# EAGLE design 6_Channel_Pulse_Generator (EAGLE 8.0.0)
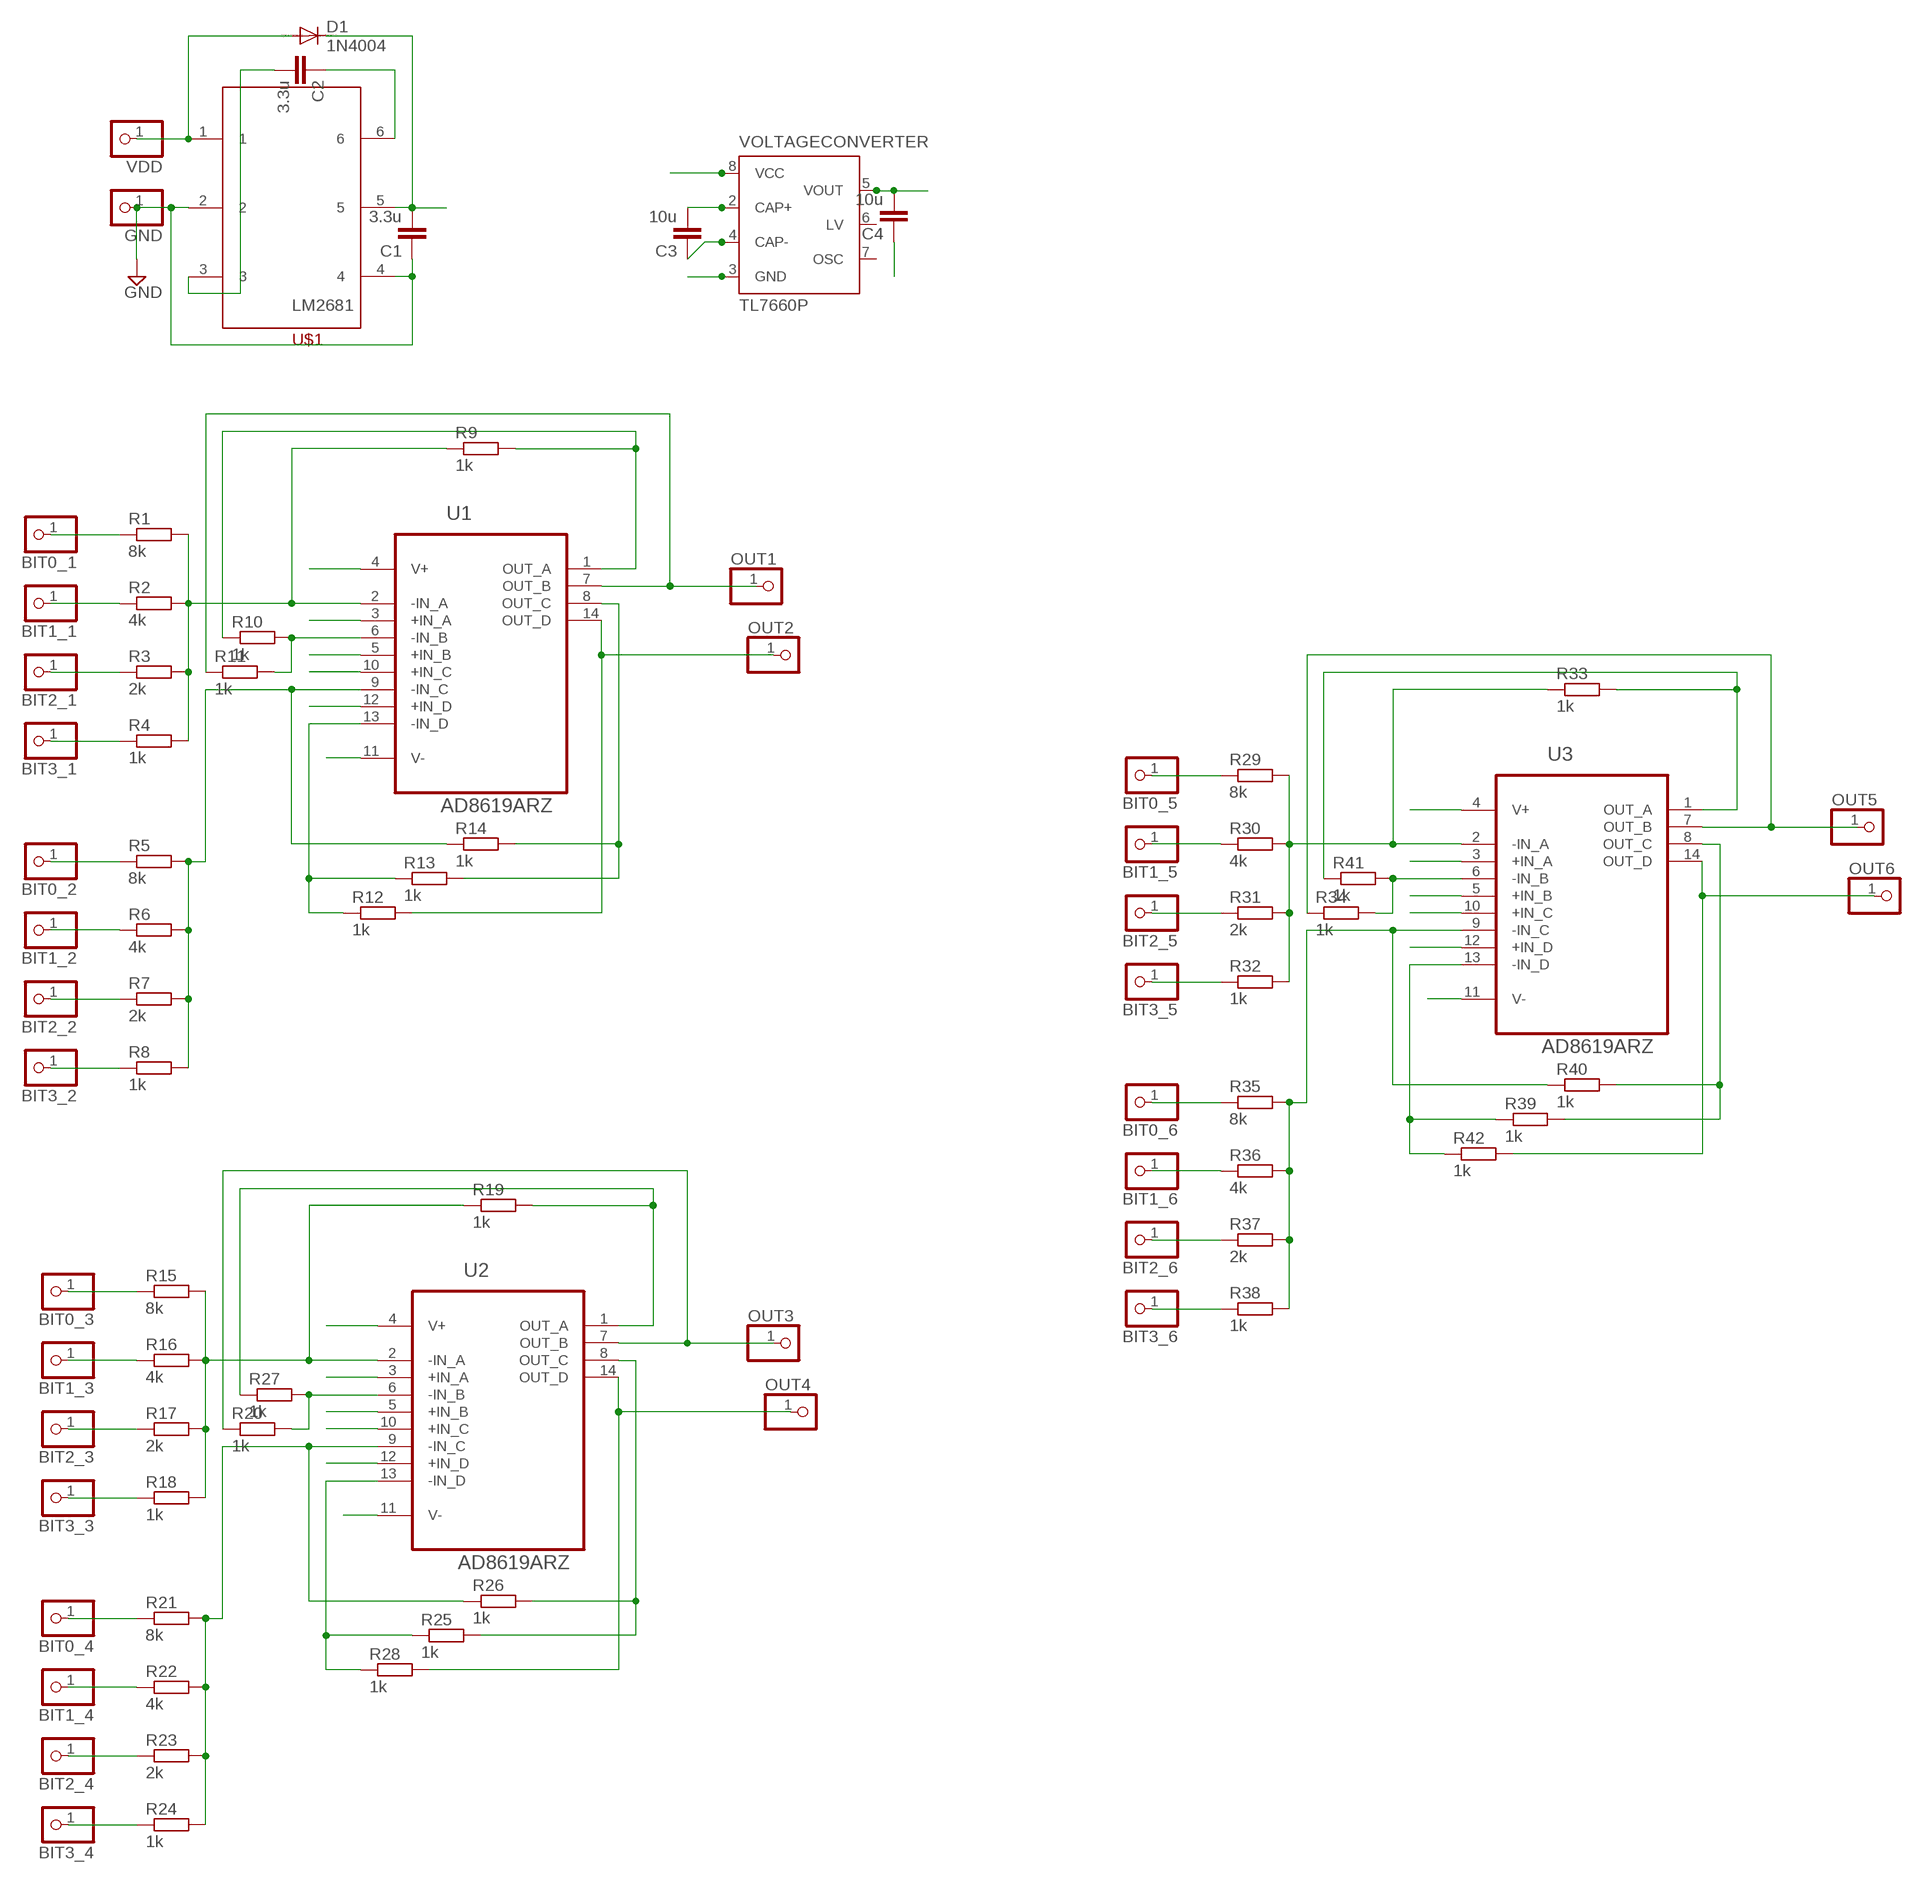
[diagram p0: schematic, sheet 1]

## Parts
BIT0_1  PINHD-1X1  [1X01]
BIT0_2  PINHD-1X1  [1X01]
BIT0_3  PINHD-1X1  [1X01]
BIT0_4  PINHD-1X1  [1X01]
BIT0_5  PINHD-1X1  [1X01]
BIT0_6  PINHD-1X1  [1X01]
BIT1_1  PINHD-1X1  [1X01]
BIT1_2  PINHD-1X1  [1X01]
BIT1_3  PINHD-1X1  [1X01]
BIT1_4  PINHD-1X1  [1X01]
BIT1_5  PINHD-1X1  [1X01]
BIT1_6  PINHD-1X1  [1X01]
BIT2_1  PINHD-1X1  [1X01]
BIT2_2  PINHD-1X1  [1X01]
BIT2_3  PINHD-1X1  [1X01]
BIT2_4  PINHD-1X1  [1X01]
BIT2_5  PINHD-1X1  [1X01]
BIT2_6  PINHD-1X1  [1X01]
BIT3_1  PINHD-1X1  [1X01]
BIT3_2  PINHD-1X1  [1X01]
BIT3_3  PINHD-1X1  [1X01]
BIT3_4  PINHD-1X1  [1X01]
BIT3_5  PINHD-1X1  [1X01]
BIT3_6  PINHD-1X1  [1X01]
C1  3.3u  C-EUC1206  [C1206]
C2  3.3u  C-EUC1206  [C1206]
C3  10u  C-EUC1206  [C1206]
C4  10u  C-EUC1206  [C1206]
D1  1N4004  [DO41-10]
GND  PINHD-1X1  [1X01]
OUT1  PINHD-1X1  [1X01]
OUT2  PINHD-1X1  [1X01]
OUT3  PINHD-1X1  [1X01]
OUT4  PINHD-1X1  [1X01]
OUT5  PINHD-1X1  [1X01]
OUT6  PINHD-1X1  [1X01]
R1  8k  R-EU_M1206  [M1206]
R2  4k  R-EU_M1206  [M1206]
R3  2k  R-EU_M1206  [M1206]
R4  1k  R-EU_M1206  [M1206]
R5  8k  R-EU_M1206  [M1206]
R6  4k  R-EU_M1206  [M1206]
R7  2k  R-EU_M1206  [M1206]
R8  1k  R-EU_M1206  [M1206]
R9  1k  R-EU_M1206  [M1206]
R10  1k  R-EU_M1206  [M1206]
R11  1k  R-EU_M1206  [M1206]
R12  1k  R-EU_M1206  [M1206]
R13  1k  R-EU_M1206  [M1206]
R14  1k  R-EU_M1206  [M1206]
R15  8k  R-EU_M1206  [M1206]
R16  4k  R-EU_M1206  [M1206]
R17  2k  R-EU_M1206  [M1206]
R18  1k  R-EU_M1206  [M1206]
R19  1k  R-EU_M1206  [M1206]
R20  1k  R-EU_M1206  [M1206]
R21  8k  R-EU_M1206  [M1206]
R22  4k  R-EU_M1206  [M1206]
R23  2k  R-EU_M1206  [M1206]
R24  1k  R-EU_M1206  [M1206]
R25  1k  R-EU_M1206  [M1206]
R26  1k  R-EU_M1206  [M1206]
R27  1k  R-EU_M1206  [M1206]
R28  1k  R-EU_M1206  [M1206]
R29  8k  R-EU_M1206  [M1206]
R30  4k  R-EU_M1206  [M1206]
R31  2k  R-EU_M1206  [M1206]
R32  1k  R-EU_M1206  [M1206]
R33  1k  R-EU_M1206  [M1206]
R34  1k  R-EU_M1206  [M1206]
R35  8k  R-EU_M1206  [M1206]
R36  4k  R-EU_M1206  [M1206]
R37  2k  R-EU_M1206  [M1206]
R38  1k  R-EU_M1206  [M1206]
R39  1k  R-EU_M1206  [M1206]
R40  1k  R-EU_M1206  [M1206]
R41  1k  R-EU_M1206  [M1206]
R42  1k  R-EU_M1206  [M1206]
U1  AD8619ARZ  [SOIC127P600X175-14N]
U2  AD8619ARZ  [SOIC127P600X175-14N]
U3  AD8619ARZ  [SOIC127P600X175-14N]
U$1  LM2681  [LM2681]
VDD  PINHD-1X1  [1X01]
VOLTAGECONVERTER  TL7660P  [DIL08]

## Nets
GND: C1.1 C4.1 GND.1 U1.3(+IN_A) U1.5(+IN_B) U1.10(+IN_C) U1.12(+IN_D) U2.3(+IN_A) U2.5(+IN_B) U2.10(+IN_C) U2.12(+IN_D) U3.3(+IN_A) U3.5(+IN_B) U3.10(+IN_C) U3.12(+IN_D) U$1.2 U$1.4 VOLTAGECONVERTER.3(GND)
N$1: BIT0_1.1 R1.1
N$2: C2.2 U$1.3
N$3: C3.2 VOLTAGECONVERTER.2(CAP+)
N$4: C3.1 VOLTAGECONVERTER.4(CAP-)
N$5: BIT1_1.1 R2.1
N$6: BIT2_1.1 R3.1
N$7: BIT3_1.1 R4.1
N$8: BIT0_2.1 R5.1
N$9: BIT2_2.1 R7.1
N$10: BIT3_2.1 R8.1
N$11: BIT1_2.1 R6.1
N$12: R1.2 R2.2 R3.2 R4.2 R9.1 U1.2(-IN_A)
N$13: R5.2 R6.2 R7.2 R8.2 R14.1 U1.9(-IN_C)
N$14: R13.2 R14.2 U1.8(OUT_C)
N$15: OUT2.1 R12.2 U1.14(OUT_D)
N$16: R12.1 R13.1 U1.13(-IN_D)
N$17: R9.2 R10.1 U1.1(OUT_A)
N$18: OUT1.1 R11.1 U1.7(OUT_B)
N$19: R10.2 R11.2 U1.6(-IN_B)
N$20: C2.1 U$1.6
N$21: BIT0_3.1 R15.1
N$22: BIT2_3.1 R17.1
N$23: BIT3_3.1 R18.1
N$24: BIT1_3.1 R16.1
N$25: BIT0_4.1 R21.1
N$26: BIT2_4.1 R23.1
N$27: BIT3_4.1 R24.1
N$28: BIT1_4.1 R22.1
N$29: R15.2 R16.2 R17.2 R18.2 R19.1 U2.2(-IN_A)
N$30: R19.2 R27.1 U2.1(OUT_A)
N$31: OUT3.1 R20.1 U2.7(OUT_B)
N$32: R20.2 R27.2 U2.6(-IN_B)
N$33: R21.2 R22.2 R23.2 R24.2 R26.1 U2.9(-IN_C)
N$34: R25.2 R26.2 U2.8(OUT_C)
N$35: R25.1 R28.1 U2.13(-IN_D)
N$36: OUT4.1 R28.2 U2.14(OUT_D)
N$37: BIT0_5.1 R29.1
N$38: BIT2_5.1 R31.1
N$39: BIT3_5.1 R32.1
N$40: BIT1_5.1 R30.1
N$41: BIT0_6.1 R35.1
N$42: BIT2_6.1 R37.1
N$43: BIT3_6.1 R38.1
N$44: BIT1_6.1 R36.1
N$45: R29.2 R30.2 R31.2 R32.2 R33.1 U3.2(-IN_A)
N$46: R33.2 R41.1 U3.1(OUT_A)
N$47: OUT5.1 R34.1 U3.7(OUT_B)
N$48: R34.2 R41.2 U3.6(-IN_B)
N$49: R35.2 R36.2 R37.2 R38.2 R40.1 U3.9(-IN_C)
N$50: R39.2 R40.2 U3.8(OUT_C)
N$51: R39.1 R42.1 U3.13(-IN_D)
N$52: OUT6.1 R42.2 U3.14(OUT_D)
VDD: C1.2 D1.C U1.4(V+) U2.4(V+) U3.4(V+) U$1.5 VOLTAGECONVERTER.8(VCC)
VDD-: C4.2 U1.11(V-) U2.11(V-) U3.11(V-) VOLTAGECONVERTER.5(VOUT)
VDD_3.3: D1.A U$1.1 VDD.1
Unconnected: VOLTAGECONVERTER.6(LV) VOLTAGECONVERTER.7(OSC)

## Library data of the parts
BIT0_1-BIT0_6 BIT1_1-BIT1_6 BIT2_1-BIT2_6 BIT3_1-BIT3_6 GND OUT1-OUT6 VDD = pinhead:PINHD-1X1: PIN HEADER
C1-C4 = rcl:C-EU: CAPACITOR, European symbol
D1 = diode:1N4004: DIODE general purpose rectifier, 1 A
R1-R42 = rcl:R-EU_: RESISTOR, European symbol
U1-U3 = AD8619ARZ:AD8619ARZ: Operational Amplifiers; AVAILABILITY: Good; DESCRIPTION: OP Amp Quad GP R-R I/O ???}2.5V/5V 14-Pin SOIC N Tube; MF: Analog Devices; MP: AD8619ARZ; PACKAGE: SOIC-14 Analog Devices; PRICE: 1.96 USD
U$1 = LM2681:LM2681
VOLTAGECONVERTER = texas:TL7660: CMOS VOLTAGE CONVERTER Source: http://focus.ti.com/lit/ds/scas794/scas794.pdf; MPN: TL7660CP; OC_FARNELL: 1755283; OC_NEWARK: 14M2447

## Board
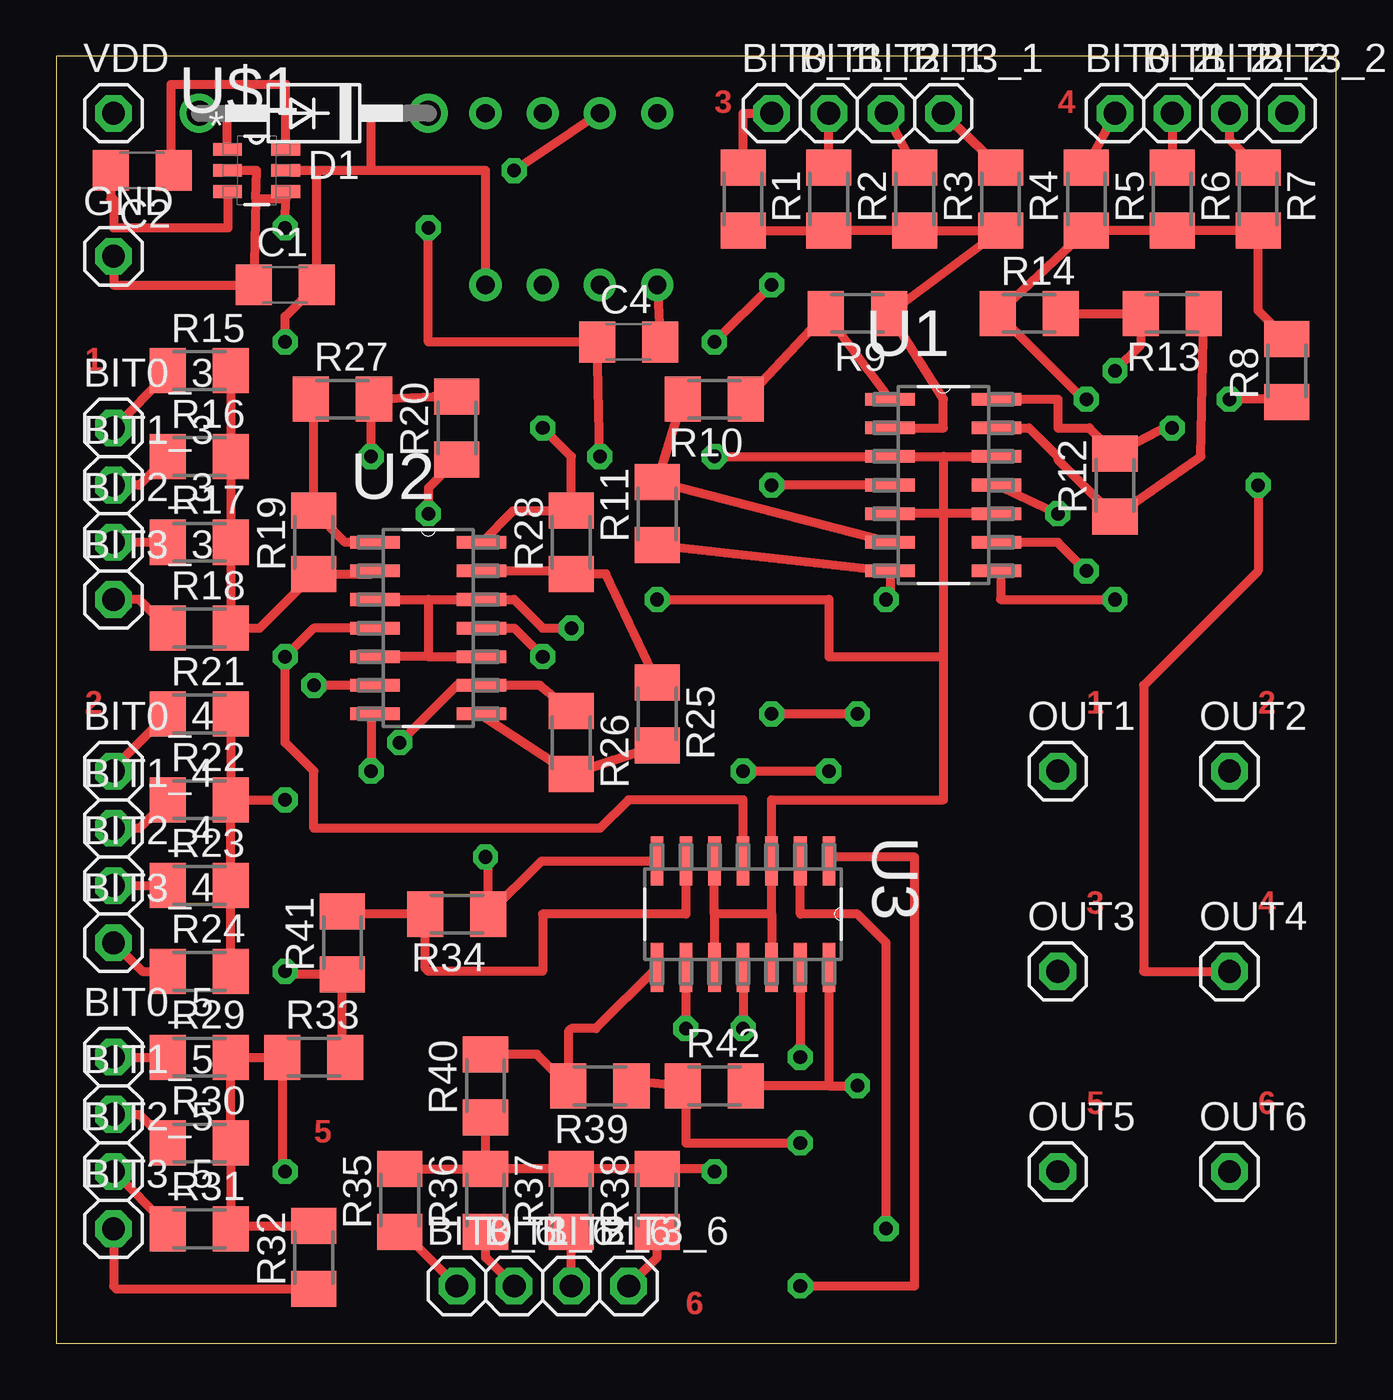
[diagram p1: board, top side]
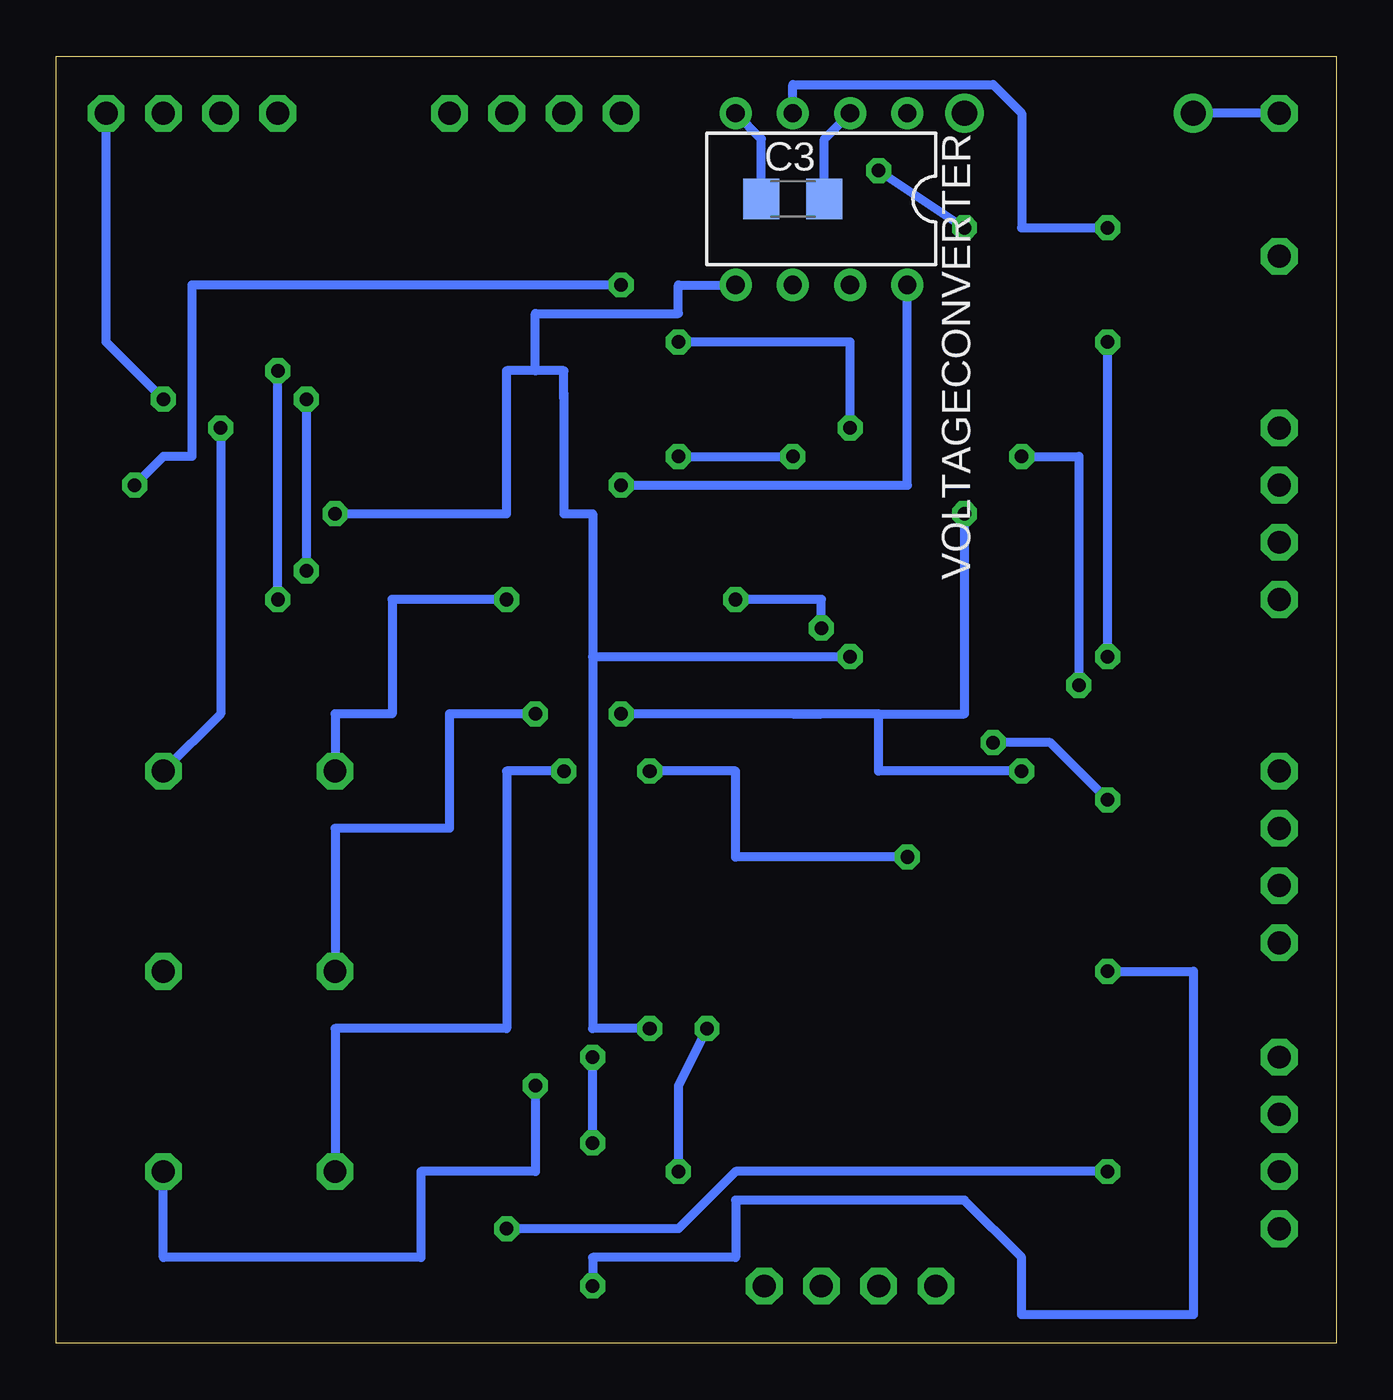
[diagram p2: board, bottom side, seen from below]

Size 56.82 x 57.14 mm. Coordinates in mm from the lower left corner, seen from the top.
Outline: 0,0 56.82,0 56.82,57.14 0,57.14 0,0
Copper layers (1*16): Top 0.035mm / dielectric 1.5mm / Bottom 0.035mm
Design rules "AdvancedCircuitsBarebones": minimum track width 6mil, minimum drill 20mil, track to track 6mil, track to pad 6mil, pad to pad 6mil, via to via 6mil, smd to smd 6mil, copper to edge 10mil, drill to drill 6mil, minimum pad ring 12mil, minimum via ring 10mil, stop-mask expansion 4mil, vias tented up to drill 25mil, thermal gap 10mil

### Footprints (pad centres in the part's own frame; a part is rotated, then mirrored left to right if it is on the bottom)
1X01 = drill 1.016 octagon: 1 0,0
C1206 = smd 1.6 x 1.8: 1 -1.4,0; 2 1.4,0
DO41-10 = drill 1.118: A 5.08,0; C -5.08,0
M1206 = smd 1.6 x 2: 1 -1.4,0; 2 1.4,0
SOIC127P600X175-14N = smd 2.184 x 0.559: 1 -2.362,3.81; 2 -2.362,2.54; 3 -2.362,1.27; 4 -2.362,0; 5 -2.362,-1.27; 6 -2.362,-2.54; 7 -2.362,-3.81; 8 2.362,-3.81; 9 2.362,-2.54; 10 2.362,-1.27; 11 2.362,0; 12 2.362,1.27; 13 2.362,2.54; 14 2.362,3.81
LM2681 = smd 1.27 x 0.559: 1 -1.295,0.94; 2 -1.295,0; 3 -1.295,-0.94; 4 1.295,-0.94; 5 1.295,0; 6 1.295,0.94
DIL08 = drill 0.813 pad 1.27: 1 -3.81,-3.81; 2 -1.27,-3.81; 3 1.27,-3.81; 4 3.81,-3.81; 5 3.81,3.81; 6 1.27,3.81; 7 -1.27,3.81; 8 -3.81,3.81

### Placement (x,y rotation side)
BIT0_1  31.75,54.61 0 top
BIT0_2  46.99,54.61 0 top
BIT0_3  2.54,40.64 0 top
BIT0_4  2.54,25.4 0 top
BIT0_5  2.54,12.7 0 top
BIT0_6  17.78,2.54 0 top
BIT1_1  34.29,54.61 0 top
BIT1_2  49.53,54.61 0 top
BIT1_3  2.54,38.1 0 top
BIT1_4  2.54,22.86 0 top
BIT1_5  2.54,10.16 0 top
BIT1_6  20.32,2.54 0 top
BIT2_1  36.83,54.61 0 top
BIT2_2  52.07,54.61 0 top
BIT2_3  2.54,35.56 0 top
BIT2_4  2.54,20.32 0 top
BIT2_5  2.54,7.62 0 top
BIT2_6  22.86,2.54 0 top
BIT3_1  39.37,54.61 0 top
BIT3_2  54.61,54.61 0 top
BIT3_3  2.54,33.02 0 top
BIT3_4  2.54,17.78 0 top
BIT3_5  2.54,5.08 0 top
BIT3_6  25.4,2.54 0 top
C1  10.16,46.99 0 top
C2  3.81,52.07 180 top
C3  24.13,50.8 0 bottom
C4  25.4,44.45 0 top
D1  11.43,54.61 180 top
GND  2.54,48.26 0 top
OUT1  44.45,25.4 0 top
OUT2  52.07,25.4 0 top
OUT3  44.45,16.51 0 top
OUT4  52.07,16.51 0 top
OUT5  44.45,7.62 0 top
OUT6  52.07,7.62 0 top
R1  30.48,50.8 270 top
R2  34.29,50.8 270 top
R3  38.1,50.8 270 top
R4  41.91,50.8 270 top
R5  45.72,50.8 270 top
R6  49.53,50.8 270 top
R7  53.34,50.8 270 top
R8  54.61,43.18 90 top
R9  35.56,45.72 180 top
R10  29.21,41.91 180 top
R11  26.67,36.83 90 top
R12  46.99,38.1 90 top
R13  49.53,45.72 180 top
R14  43.18,45.72 0 top
R15  6.35,43.18 0 top
R16  6.35,39.37 0 top
R17  6.35,35.56 0 top
R18  6.35,31.75 0 top
R19  11.43,35.56 90 top
R20  17.78,40.64 90 top
R21  6.35,27.94 0 top
R22  6.35,24.13 0 top
R23  6.35,20.32 0 top
R24  6.35,16.51 0 top
R25  26.67,27.94 270 top
R26  22.86,26.67 270 top
R27  12.7,41.91 0 top
R28  22.86,35.56 90 top
R29  6.35,12.7 0 top
R30  6.35,8.89 0 top
R31  6.35,5.08 0 top
R32  11.43,3.81 90 top
R33  11.43,12.7 0 top
R34  17.78,19.05 180 top
R35  15.24,6.35 90 top
R36  19.05,6.35 90 top
R37  22.86,6.35 90 top
R38  26.67,6.35 90 top
R39  24.13,11.43 180 top
R40  19.05,11.43 90 top
R41  12.7,17.78 90 top
R42  29.21,11.43 0 top
U1  39.37,38.1 0 top
U2  16.51,31.75 0 top
U3  30.48,19.05 270 top
U$1  8.89,52.07 0 top
VDD  2.54,54.61 0 top
VOLTAGECONVERTER  22.86,50.8 180 bottom

### Tracks (layer width: path | path; a pad name or v marks a point on that pad's centre or on a via)
GND  (via drill 0.6)
  Top 0.406: GND.1 2.54,46.99 C1.1 8.86,50.8 | v10.16,49.53 U$1.4 10.19,50.8 8.86,50.8 | 8.86,50.8 8.89,52.07 U$1.2 | v16.51,49.53 16.51,44.45 C4.1 v24.13,39.37 | v20.32,52.07 VOLTAGECONVERTER.3 | v29.21,39.37 U1.3 39.37,39.37 | 39.37,39.37 U1.12 | U1.10 39.37,36.83 | 39.37,36.83 U1.5 | 39.37,39.37 39.37,36.83 | U2.3 16.51,33.02 | 16.51,33.02 U2.12 20.32,33.02 21.59,31.75 v22.86,31.75 | 16.51,30.48 U2.5 | 16.51,30.48 U2.10 | 16.51,33.02 16.51,30.48 | 31.75,19.05 U3.3 31.75,24.13 39.37,24.13 39.37,30.48 | 31.75,19.05 U3.12 | 29.21,19.05 U3.10 | 29.21,19.05 U3.5 | 31.75,19.05 29.21,19.05 | v26.67,33.02 34.29,33.02 34.29,30.48 39.37,30.48 | 39.37,36.83 39.37,30.48
  Bottom 0.406: VOLTAGECONVERTER.3 24.13,55.88 15.24,55.88 13.97,54.61 13.97,49.53 v10.16,49.53 | v16.51,49.53 v20.32,52.07 | v29.21,39.37 v24.13,39.37 | v22.86,31.75 22.86,33.02 v26.67,33.02
N$1
  Top 0.406: R1.1 30.48,54.61 BIT0_1.1
N$2
  Top 0.406: C2.2 2.41,50.8 2.54,50.8 2.54,49.53 7.62,49.53 7.62,51.13 U$1.3
N$3
  Bottom 0.406: C3.2 22.73,53.47 VOLTAGECONVERTER.2
N$4
  Bottom 0.406: C3.1 25.53,53.47 VOLTAGECONVERTER.4
N$5
  Top 0.406: R2.1 BIT1_1.1
N$6
  Top 0.406: R3.1 BIT2_1.1
N$7
  Top 0.406: BIT3_1.1 R4.1
N$8
  Top 0.406: BIT0_2.1 R5.1
N$9
  Top 0.406: BIT2_2.1 52.07,53.47 R7.1
N$10  (via drill 0.6)
  Top 0.406: R8.1 54.48,41.91 v52.07,41.91
  Bottom 0.406: v52.07,41.91 54.61,44.45 BIT3_2.1
N$11
  Top 0.406: BIT1_2.1 R6.1
N$12
  Top 0.406: R1.2 R2.2 R3.2 R4.2 R9.1 39.37,41.91 39.37,40.64 U1.2
N$13  (via drill 0.6)
  Top 0.406: R8.2 53.34,45.85 R7.2 R6.2 R5.2 R14.1 45.59,41.91 v45.72,41.91 | v45.72,34.29 44.45,35.56 U1.9
  Bottom 0.406: v45.72,41.91 v45.72,34.29
N$14  (via drill 0.6)
  Top 0.406: R14.2 R13.2 48.13,44.32 v46.99,43.18 | U1.8 41.91,34.11 41.91,33.02 v46.99,33.02
  Bottom 0.406: v46.99,33.02 v46.99,43.18
N$15  (via drill 0.6)
  Top 0.406: v49.53,40.64 49.4,40.77 R12.2 45.85,40.64 44.45,40.64 44.45,41.91 U1.14
  Bottom 0.406: OUT2.1 49.53,27.94 v49.53,40.64
N$16
  Top 0.406: R13.1 50.8,39.37 R12.1 44.45,39.24 44.45,39.37 43.18,40.64 U1.13
N$17
  Top 0.406: R10.1 R9.2 U1.1
N$18  (via drill 0.6)
  Top 0.406: R11.1 U1.7 37.01,33.2 v36.83,33.02
  Bottom 0.406: v36.83,33.02 41.91,33.02 41.91,27.94 44.45,27.94 OUT1.1
N$19
  Top 0.406: R10.2 R11.2 U1.6
N$20
  Top 0.406: U$1.6 10.19,55.88 5.08,55.88 5.08,52.07 C2.1
N$21
  Top 0.406: BIT0_3.1 4.95,43.05 R15.1
N$22
  Top 0.406: R17.1 BIT2_3.1
N$23
  Top 0.406: R18.1 3.68,33.02 BIT3_3.1
N$24
  Top 0.406: R16.1 3.68,38.1 BIT1_3.1
N$25
  Top 0.406: R21.1 2.54,25.53 BIT0_4.1
N$26
  Top 0.406: BIT2_4.1 R23.1
N$27
  Top 0.406: BIT3_4.1 3.81,16.51 R24.1
N$28
  Top 0.406: R22.1 3.68,22.86 BIT1_4.1
N$29
  Top 0.406: R15.2 R16.2 R17.2 R18.2 9.02,31.75 R19.1 14.02,34.16 U2.2
N$30
  Top 0.406: R27.1 11.43,41.78 R19.2 12.83,35.56 U2.1
N$31  (via drill 0.6)
  Top 0.406: R20.1 16.51,37.97 v16.51,36.83 | U2.7 13.97,27.76 v13.97,25.4 | v35.56,27.94 v31.75,27.94
  Bottom 0.406: 24.13,27.94 v31.75,27.94 | 24.13,27.94 22.86,27.94 | v35.56,27.94 39.37,27.94 39.37,22.86 44.45,22.86 OUT3.1 | v16.51,36.83 16.51,27.94 20.32,27.94 | 20.32,27.94 24.13,27.94 | v13.97,25.4 20.32,25.4 20.32,27.94
N$32  (via drill 0.6)
  Top 0.406: R20.2 16.77,42.04 R27.2 13.97,41.78 v13.97,39.37 | U2.6 v11.43,29.21
  Bottom 0.406: v13.97,39.37 11.43,39.37 v11.43,29.21
N$33  (via drill 0.6)
  Top 0.406: R21.2 R22.2 | R22.2 R23.2 R24.2 | R26.1 21.46,29.21 U2.9 17.78,29.21 v15.24,26.67 | R22.2 v10.16,24.13
  Bottom 0.406: v10.16,24.13 12.7,26.67 v15.24,26.67
N$34
  Top 0.406: R25.2 R26.2 19,27.81 U2.8
N$35
  Top 0.406: R25.1 24.39,34.16 R28.1 22.73,34.29 U2.13
N$36  (via drill 0.6)
  Top 0.406: U2.14 20.27,36.96 R28.2 22.86,39.37 v21.59,40.64 | v29.21,44.45 v31.75,46.99 | v53.34,38.1 53.34,34.29 48.26,29.21 48.26,16.51 OUT4.1
  Bottom 0.406: v53.34,38.1 52.07,39.37 50.8,39.37 50.8,46.99 v31.75,46.99 | v21.59,40.64 21.59,44.45 v29.21,44.45
N$37
  Top 0.406: BIT0_5.1 R29.1
N$38
  Top 0.406: BIT2_5.1 4.95,5.21 R31.1
N$39
  Top 0.406: BIT3_5.1 2.54,2.54 2.67,2.41 R32.1
N$40
  Top 0.406: BIT1_5.1 3.68,10.16 R30.1
N$41
  Top 0.406: BIT0_6.1 15.37,4.95 R35.1
N$42
  Top 0.406: BIT2_6.1 R37.1
N$43
  Top 0.406: BIT3_6.1 26.67,3.81 R38.1
N$44
  Top 0.406: BIT1_6.1 19.05,3.81 R36.1
N$45  (via drill 0.6)
  Top 0.406: R32.2 7.88,5.21 R31.2 R30.2 R29.2 R33.1 10.03,7.75 v10.16,7.62 | v36.83,5.08 36.83,17.78 35.56,19.05 33.02,19.05 U3.2
  Bottom 0.406: v10.16,7.62 26.67,7.62 29.21,5.08 v36.83,5.08
N$46  (via drill 0.6)
  Top 0.406: R33.2 12.7,12.83 R41.1 10.29,16.38 v10.16,16.51 | v33.02,2.54 38.1,2.54 38.1,21.59 34.47,21.59 U3.1
  Bottom 0.406: v10.16,16.51 6.35,16.51 6.35,1.27 13.97,1.27 13.97,3.81 16.51,6.35 26.67,6.35 26.67,3.81 33.02,3.81 v33.02,2.54
N$47  (via drill 0.6)
  Top 0.406: U3.7 21.54,21.41 R34.1 19.18,21.46 v19.05,21.59 | v30.48,25.4 v34.29,25.4
  Bottom 0.406: v34.29,25.4 36.83,25.4 36.83,13.97 44.45,13.97 OUT5.1 | v19.05,21.59 26.67,21.59 26.67,25.4 v30.48,25.4
N$48
  Top 0.406: R41.2 12.83,19.05 R34.2 16.38,16.64 16.51,16.51 21.59,16.51 21.59,19.05 27.94,19.05 U3.6
N$49  (via drill 0.6)
  Top 0.406: R36.2 R37.2 R38.2 29.08,7.75 v29.21,7.62 | R35.2 R36.2 | R36.2 R40.1 | U3.9 v27.94,13.97
  Bottom 0.406: v27.94,13.97 29.21,11.43 v29.21,7.62
N$50
  Top 0.406: R40.2 21.33,12.83 R39.2 22.73,13.84 22.86,13.97 23.95,13.97 U3.8
N$51  (via drill 0.6)
  Top 0.406: R39.1 25.27,11.69 R42.1 27.94,11.3 27.94,8.89 v33.02,8.89 | U3.13 v33.02,12.7
  Bottom 0.406: v33.02,8.89 v33.02,12.7
N$52  (via drill 0.6)
  Top 0.406: U3.14 34.29,11.43 | 34.29,11.43 R42.2 | 34.29,11.43 v35.56,11.43
  Bottom 0.406: OUT6.1 52.07,3.81 40.64,3.81 40.64,7.62 35.56,7.62 v35.56,11.43
VDD  (via drill 0.6)
  Top 0.406: 11.56,52.07 U$1.5 | 13.97,52.07 11.56,52.07 | 13.97,52.07 13.97,54.61 D1.C | 11.56,52.07 C1.2 10.16,45.59 v10.16,44.45 | VOLTAGECONVERTER.8 19.05,52.07 13.97,52.07 | U1.4 v31.75,38.1 | U2.4 11.43,31.75 v10.16,30.48 10.16,26.67 11.43,25.4 11.43,22.86 24.13,22.86 25.4,24.13 30.48,24.13 U3.4
  Bottom 0.406: v31.75,38.1 19.05,38.1 VOLTAGECONVERTER.8 | v10.16,30.48 v10.16,44.45
VDD-  (via drill 0.6)
  Top 0.406: VOLTAGECONVERTER.5 C4.2 | U1.11 v44.45,36.83 | U2.11 20.32,31.75 v21.59,30.48 | U3.11 v30.48,13.97
  Bottom 0.406: 33.02,30.48 v21.59,30.48 | 34.29,42.14 34.29,41.91 | 34.29,41.91 34.29,36.83 33.02,36.83 33.02,30.48 | v30.48,13.97 33.02,13.97 33.02,30.48 | v44.45,36.83 36.83,36.83 36.83,43.18 35.56,43.18 | 35.56,43.18 35.56,45.72 29.21,45.72 29.21,46.99 VOLTAGECONVERTER.5 | 34.29,41.91 34.29,43.18 35.56,43.18
VDD_3.3
  Top 0.406: U$1.1 7.59,54.61 7.62,54.61 D1.A
  Bottom 0.406: VDD.1 D1.A

### Text on the board
Top: 3 | 4 | 1 | 2 | 1 | 2 | 3 | 4 | 5 | 6 | 5 | 6